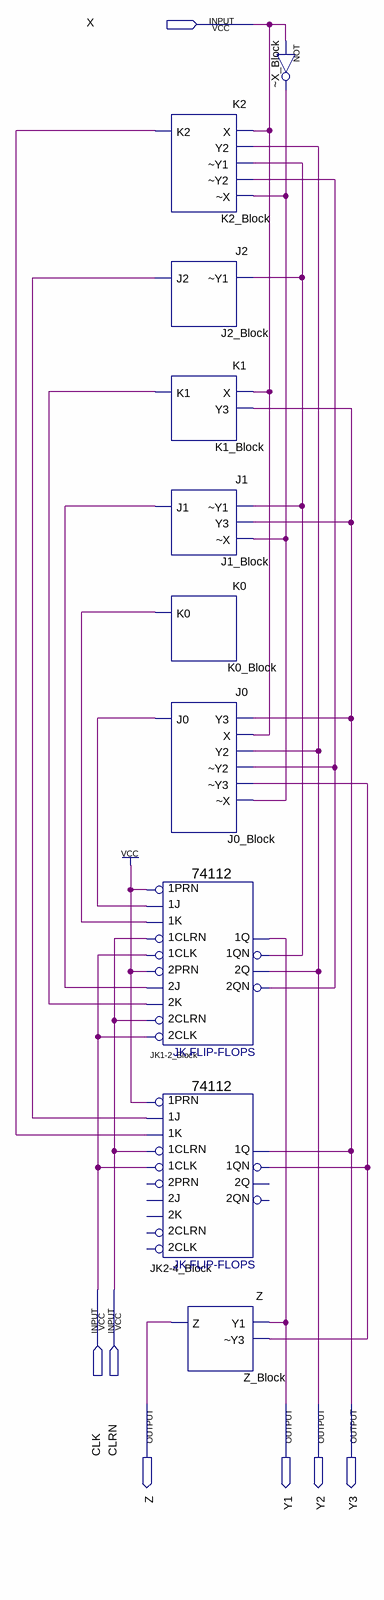
[diagram p0: schematic sheet]
// Quartus schematic Lock.bdf as structural Verilog: 10 symbols, 7 pins
module Lock (
  input  X,
  input  CLK,
  input  CLRN,
  output Z,
  output Y1,
  output Y2,
  output Y3
);

  wire _X_Block_out, J0_Block_j0, J1_Block_j1, J2_Block_j2, JK1_2_Block_1qn, JK1_2_Block_2qn,
       JK2_4_Block_1qn, K0_Block_k0, K1_Block_k1, K2_Block_k2;

  K2 K2_Block (.X(X), .Y2(Y2), .\~Y1 (JK1_2_Block_1qn), .\~Y2 (JK1_2_Block_2qn), .\~X (_X_Block_out), .K2(K2_Block_k2));
  J2 J2_Block (.\~Y1 (JK1_2_Block_1qn), .J2(J2_Block_j2));
  K1 K1_Block (.X(X), .Y3(Y3), .K1(K1_Block_k1));
  J1 J1_Block (.\~Y1 (JK1_2_Block_1qn), .Y3(Y3), .\~X (_X_Block_out), .J1(J1_Block_j1));
  K0 K0_Block (.K0(K0_Block_k0));
  J0 J0_Block (
    .Y3(Y3), .X(X), .Y2(Y2), .\~Y2 (JK1_2_Block_2qn), .\~Y3 (JK2_4_Block_1qn), .\~X (_X_Block_out),
    .J0(J0_Block_j0));
  \74112  \JK1-2_Block  (
    .\1K (K0_Block_k0), .\1J (J0_Block_j0), .\1PRN (1'b1), .\1CLK (CLK), .\1CLRN (CLRN), .\2K (K1_Block_k1),
    .\2J (J1_Block_j1), .\2PRN (1'b1), .\2CLK (CLK), .\2CLRN (CLRN), .\1QN (JK1_2_Block_1qn), .\2Q (Y2),
    .\1Q (Y1), .\2QN (JK1_2_Block_2qn));
  \74112  \JK2-4_Block  (
    .\1K (K2_Block_k2), .\1J (J2_Block_j2), .\1PRN (1'b1), .\1CLK (CLK), .\1CLRN (CLRN),
    .\1QN (JK2_4_Block_1qn), .\1Q (Y3));  // open: 2K, 2J, 2PRN, 2CLK, 2CLRN, 2Q, 2QN
  Z Z_Block (.Y1(Y1), .\~Y3 (JK2_4_Block_1qn), .Z(Z));
  not \u_~X_Block  (_X_Block_out, X);
endmodule
